# Altium project ALCT_MEZ_SPARTAN6.PrjPcb (part 5 of 5)

## Sheet ADC.SchDoc: ADC
size A; Organization: UCLA High Energy Physics; DocumentNumber: 8; Revision: 2.0; SheetNumber: 8; SheetTotal: 12; CurrentDate: 8/7/2018; ModifiedDate: 8/20/2018
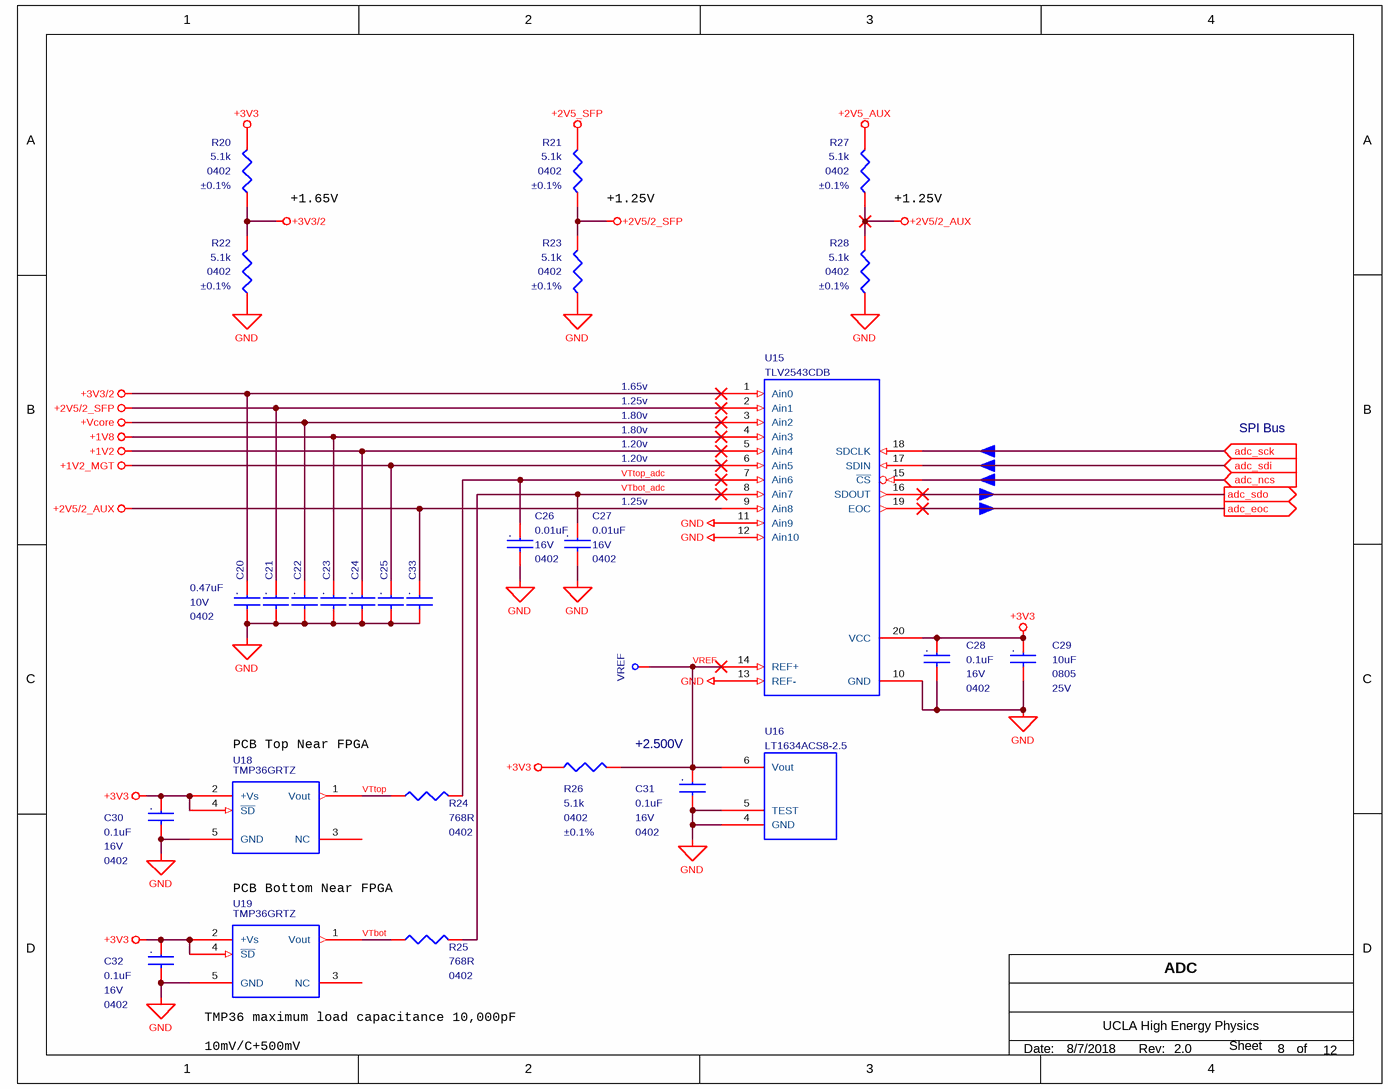
[diagram p15: ADC.SchDoc]

### Parts
C20  0.47uF  package: 0402  Voltage - Rated: 10V  [MC_S6/SM/C_0402_IPC]
C21  0.47uF  [MC_S6/SM/C_0402_IPC]  (value not drawn)
C22  0.47uF  [MC_S6/SM/C_0402_IPC]  (value not drawn)
C23  0.47uF  [MC_S6/SM/C_0402_IPC]  (value not drawn)
C24  0.47uF  [MC_S6/SM/C_0402_IPC]  (value not drawn)
C25  0.47uF  [MC_S6/SM/C_0402_IPC]  (value not drawn)
C26  0.01uF  Voltage - Rated: 16V  package: 0402  [MC_S6/SM/C_0402_IPC]
C27  0.01uF  Voltage - Rated: 16V  package: 0402  [MC_S6/SM/C_0402_IPC]
C28  0.1uF  package: 0402  Voltage - Rated: 16V  [MC_S6/SM/C_0402_IPC]
C29  10uF  Voltage - Rated: 25V  package: 0805  [MC_S6/SM/C_0805_IPC]
C30  0.1uF  package: 0402  Voltage - Rated: 16V  [MC_S6/SM/C_0402_IPC]
C31  0.1uF  package: 0402  Voltage - Rated: 16V  [MC_S6/SM/C_0402_IPC]
C32  0.1uF  package: 0402  Voltage - Rated: 16V  [MC_S6/SM/C_0402_IPC]
C33  0.47uF  [MC_S6/SM/C_0402_IPC]  (value not drawn)
R20  5.1k  Tolerance: ±0.1%  Supplier Device Package: 0402  [MC_S6/SM/R_0402_IPC]
R21  5.1k  Tolerance: ±0.1%  Supplier Device Package: 0402  [MC_S6/SM/R_0402_IPC]
R22  5.1k  Tolerance: ±0.1%  Supplier Device Package: 0402  [MC_S6/SM/R_0402_IPC]
R23  5.1k  Tolerance: ±0.1%  Supplier Device Package: 0402  [MC_S6/SM/R_0402_IPC]
R24  768R  Supplier Device Package: 0402  [MC_S6/SM/R_0402_IPC]
R25  768R  Supplier Device Package: 0402  [MC_S6/SM/R_0402_IPC]
R26  5.1k  Tolerance: ±0.1%  Supplier Device Package: 0402  [MC_S6/SM/R_0402_IPC]
R27  5.1k  Tolerance: ±0.1%  Supplier Device Package: 0402  [MC_S6/SM/R_0402_IPC]
R28  5.1k  Tolerance: ±0.1%  Supplier Device Package: 0402  [MC_S6/SM/R_0402_IPC]
U15  TLV2543CDB  [MC_S6/SM/ADC_DB20]
U16  LT1634ACS8-2.5  [MC_S6/SM/LT1634_SOIC8]
U18  TMP36GRTZ  [MC_S6/SM/SOT23_RJ5]
U19  TMP36GRTZ  [MC_S6/SM/SOT23_RJ5]
VREF  Test Point Via  [MC_S6/TH/TPVIA]  (value not drawn)  (no BOM)

### Ports
adc_eoc (out), adc_ncs (in), adc_sck (in), adc_sdi (in), adc_sdo (out)

### Nets
+1V2: C24.1 U15.5(Ain4)
+1V2_MGT: C25.1 U15.6(Ain5)
+1V8: C23.1 U15.4(Ain3)
+2V5/2_AUX: C33.1 R27.2 R28.1 U15.9(Ain8)
+2V5/2_SFP: C21.1 R21.2 R23.1 U15.2(Ain1)
+2V5_AUX: R27.1
+2V5_SFP: R21.1
+3V3: C28.1 C29.1 C30.1 C32.1 R20.1 R26.1 U15.20(VCC) U18.2(+Vs) U18.4(~{SD}) U19.2(+Vs) U19.4(~{SD})
+3V3/2: C20.1 R20.2 R22.1 U15.1(Ain0)
+Vcore: C22.1 U15.3(Ain2)
GND: C20.2 C21.2 C22.2 C23.2 C24.2 C25.2 C26.2 C27.2 C28.2 C29.2 C30.2 C31.2 C32.2 C33.2 R22.2 R23.2 R28.2 U15.10(GND) U15.11(Ain9) U15.12(Ain10) U15.13(REF-) U16.4(GND) U16.5(TEST) U18.5(GND) U19.5(GND)
adc_eoc: U15.19(EOC) ; port adc_eoc
adc_ncs: U15.15(~{CS}) ; port adc_ncs
adc_sck: U15.18(SDCLK) ; port adc_sck
adc_sdi: U15.17(SDIN) ; port adc_sdi
adc_sdo: U15.16(SDOUT) ; port adc_sdo
VREF: C31.1 R26.2 U15.14(REF+) U16.6(Vout) VREF.1(In)
VTbot: R25.1 U19.1(Vout)
VTbot_adc: C27.1 R25.2 U15.8(Ain7)
VTtop: R24.1 U18.1(Vout)
VTtop_adc: C26.1 R24.2 U15.7(Ain6)

Not connected (* = marked no-connect by the designer): U18 3(NC); U19 3(NC)

### Notes on the sheet
- +1.65V
- (near R21) +1.25V
- (near R27) +1.25V
- 1.65v
- 1.25v
- 1.80v
- 1.20v
- SPI Bus
- (near C27) 1.25v
- (near U18) PCB Top Near FPGA
- +2.500V
- PCB Bottom Near FPGA
- (near U19) TMP36 maximum load capacitance 10,000pF
- 10mV/C+500mV
- Date:
- Rev:
- of
- Sheet
- (in symbol C0402C103K4RACTU) .
- (in symbol C0402C104K4RACTU) .
- (in symbol GRM21BR61E106KA73L) .
- (in symbol GRM155R61A474KE15J) .

### Library data of the parts
C20-C25 C33 = GRM155R61A474KE15J: CAP CER 0.47UF 10V X5R 0402; Manufacturer: Murata Electronics North America; Capacitance: 0.47µF; Tolerance: ±10%; Supplier 1: Digi-Key; Manufacturer Part Number: GRM155R61A474KE15J; RoHS: RoHS Compliant; Category: Capacitors; Stock 1: 35266; Pricing 1: 1=0.1, 10=0.074, 100=0.0329, 500=0.02348, 1000=0.01845, 2500=0.01678, 5000=0.01543 (USD); Packaging: Cut Tape (CT); Part Status: Active; Operating Temperature: -55°C ~ 85°C; Features: -; Ratings: -; Applications: General Purpose; Mounting Type: Surface Mount, MLCC; Package / Case: 0402 (1005 Metric); Size / Dimension: 0.039" L x 0.020" W (1.00mm x 0.50mm); Height - Seated (Max): -; Thickness (Max): 0.022" (0.55mm); Lead Spacing: -; ComponentLink1URL: http://www.murata.com/~/media/webrenewal/support/library/catalog/products/capacitor/mlcc/c02e.ashx; ComponentLink1Description: http://www.murata.com/~/media/webrenewal/support/library/catalog/products/capacitor/mlcc/c02e.ashx; Supplier 2: Digi-Key; Stock 2: 35286; Pricing 2: 1=0.1, 10=0.074, 100=0.0329, 500=0.02348, 1000=0.01845, 2500=0.01678, 5000=0.01543 (USD); Supplier Part Number 1: 490-6305-1-ND; Supplier Part Number 2: 490-6305-6-ND; Temperature Coefficient: X5R
  C21-C25 C33: package: 0402; Voltage - Rated: 10V
C26 C27 = C0402C103K4RACTU: CAP CER 10nF 16V X7R 0402; Manufacturer: KEMET; Capacitance: 10000pF; Tolerance: ±10%; Supplier 1: Digi-Key; Manufacturer Part Number: C0402C103K4RACTU; RoHS: RoHS Compliant; Category: Capacitors; Stock 1: 605739; Pricing 1: 1=0.1, 10=0.02, 25=0.0144, 50=0.0108, 100=0.0088, 250=0.00732, 500=0.00626, 1000=0.00492, 5000=0.00412 (USD); Packaging: Cut Tape (CT); Part Status: Active; Temperature Coefficient: X7R; Operating Temperature: -55°C ~ 125°C; Features: -; Ratings: -; Applications: General Purpose; Mounting Type: Surface Mount, MLCC; Package / Case: 0402 (1005 Metric); Size / Dimension: 0.039" L x 0.020" W (1.00mm x 0.50mm); Height - Seated (Max): -; Thickness (Max): 0.022" (0.55mm); Lead Spacing: -; Lead Style: -; ComponentLink1URL: http://www.kemet.com/docfinder?Partnumber=C0402C103K4RACTU; ComponentLink1Description: http://www.kemet.com/docfinder?Partnumber=C0402C103K4RACTU; Supplier 2: Digi-Key; Stock 2: 605739; Pricing 2: 1=0.1, 10=0.02, 25=0.0144, 50=0.0108, 100=0.0088, 250=0.00732, 500=0.00626, 1000=0.00492, 5000=0.00412 (USD); Supplier Part Number 1: 399-1038-1-ND; Supplier Part Number 2: 399-1038-6-ND; Failure Rate: -
C28 C30-C32 = C0402C104K4RACTU: CAP CER 0.1UF 16V X7R 0402; Manufacturer: KEMET; Capacitance: 0.10µF; Tolerance: ±10%; Supplier 1: Digi-Key; Manufacturer Part Number: C0402C104K4RACTU; RoHS: RoHS Compliant; Category: Capacitors; Stock 1: 3565698; Pricing 1: 1=0.11, 10=0.078, 25=0.0568, 50=0.0442, 100=0.0365, 250=0.03024, 500=0.02562, 1000=0.02121, 5000=0.01806 (USD); Packaging: Cut Tape (CT); Part Status: Active; Operating Temperature: -55°C ~ 125°C; Features: -; Ratings: -; Applications: General Purpose; Failure Rate: -; Mounting Type: Surface Mount, MLCC; Package / Case: 0402 (1005 Metric); Size / Dimension: 0.039" L x 0.020" W (1.00mm x 0.50mm); Height - Seated (Max): -; Thickness (Max): 0.022" (0.55mm); Lead Spacing: -; Lead Style: -; ComponentLink1URL: http://www.kemet.com/docfinder?Partnumber=C0402C104K4RACTU; ComponentLink1Description: http://www.kemet.com/docfinder?Partnumber=C0402C104K4RACTU; Supplier 2: Digi-Key; Stock 2: 3565998; Pricing 2: 1=0.11, 10=0.078, 25=0.0568, 50=0.0442, 100=0.0365, 250=0.03024, 500=0.02562, 1000=0.02121, 5000=0.01806 (USD); Supplier Part Number 1: 399-3521-1-ND; Supplier Part Number 2: 399-3521-6-ND; Temperature Coefficient: X7R
C29 = GRM21BR61E106KA73L: CAP CER 10UF 25V X5R 0805; Manufacturer: Murata Electronics North America; Capacitance: 10µF; Tolerance: ±10%; Supplier 1: Digi-Key; Manufacturer Part Number: GRM21BR61E106KA73L; RoHS: RoHS Compliant; Category: Capacitors; Stock 1: 607428; Pricing 1: 1=0.19, 10=0.13, 50=0.0748, 100=0.0618, 250=0.052, 500=0.04356, 1000=0.03575 (USD); Packaging: Cut Tape (CT); Part Status: Active; Temperature Coefficient: X5R; Operating Temperature: -55°C ~ 85°C; Features: -; Ratings: -; Applications: General Purpose; Mounting Type: Surface Mount, MLCC; Package / Case: 0805 (2012 Metric); Size / Dimension: 0.079" L x 0.049" W (2.00mm x 1.25mm); Height - Seated (Max): -; Thickness (Max): 0.053" (1.35mm); Lead Spacing: -; Lead Style: -; ComponentLink1URL: http://www.murata.com/~/media/webrenewal/support/library/catalog/products/capacitor/mlcc/c02e.pdf; ComponentLink1Description: http://www.murata.com/~/media/webrenewal/support/library/catalog/products/capacitor/mlcc/c02e.pdf; Supplier 2: Digi-Key; Supplier Part Number 1: 490-5523-1-ND; Supplier Part Number 2: 490-5523-6-ND
R20-R23 R26-R28 = ERA-2AEB512X: RES SMD 5.1K OHM 0.1% 1/16W 0402; Manufacturer: Panasonic Electronic Components; Power (Watts): 0.063W, 1/16W; Temperature Coefficient: ±25ppm/°C; Supplier 1: Digi-Key; Manufacturer Part Number: ERA-2AEB512X; RoHS: RoHS Compliant; Category: Resistors; Stock 1: 26098; Pricing 1: 1=0.61, 50=0.238, 100=0.1913, 250=0.14876, 500=0.1122, 1000=0.0867, 5000=0.0646 (USD); Packaging: Cut Tape (CT); Part Status: Active; Resistance (Ohms): 5.1k; Composition: Thin Film; Features: Automotive AEC-Q200; Operating Temperature: -55°C ~ 155°C; Package / Case: 0402 (1005 Metric); Size / Dimension: 0.039" L x 0.020" W (1.00mm x 0.50mm); Height - Seated (Max): 0.016" (0.40mm); Number of Terminations: 2; Failure Rate: -; ComponentLink1URL: https://industrial.panasonic.com/cdbs/www-data/pdf/RDA0000/AOA0000C237.pdf; ComponentLink1Description: https://industrial.panasonic.com/cdbs/www-data/pdf/RDA0000/AOA0000C237.pdf; Supplier 2: Digi-Key; Stock 2: 26098; Pricing 2: 1=0.61, 50=0.238, 100=0.1913, 250=0.14876, 500=0.1122, 1000=0.0867, 5000=0.0646 (USD); Supplier Part Number 1: P5.1KDCCT-ND; Supplier Part Number 2: P5.1KDCDKR-ND
R24 R25 = ERJ-2RKF7680X: RES SMD 768 OHM 5.0% 1/10W 0402; Manufacturer: Panasonic Electronic Components; Tolerance: ±1%; Power (Watts): 0.1W, 1/10W; Temperature Coefficient: ±100ppm/°C; Supplier 1: Digi-Key; Manufacturer Part Number: ERJ-2RKF7680X; RoHS: RoHS Compliant; Category: Resistors; Stock 1: 54378; Pricing 1: 1=0.1, 10=0.039, 100=0.016, 1000=0.00719, 2500=0.00624, 5000=0.00515 (USD); Packaging: Cut Tape (CT); Part Status: Active; Composition: Thick Film; Features: Automotive AEC-Q200; Operating Temperature: -55°C ~ 155°C; Package / Case: 0402 (1005 Metric); Size / Dimension: 0.039" L x 0.020" W (1.00mm x 0.50mm); Height - Seated (Max): 0.016" (0.40mm); Failure Rate: -; ComponentLink1URL: https://industrial.panasonic.com/cdbs/www-data/pdf/RDA0000/AOA0000C304.pdf; ComponentLink1Description: https://industrial.panasonic.com/cdbs/www-data/pdf/RDA0000/AOA0000C304.pdf; Supplier 2: Digi-Key; Stock 2: 54378; Pricing 2: 1=0.1, 10=0.039, 100=0.016, 1000=0.00719, 2500=0.00624, 5000=0.00515 (USD); Supplier Part Number 1: P768LCT-ND; Supplier Part Number 2: P768LDKR-ND
U15 = TLV2543CDB: IC SERIAL OUT A/D 11-CH 20-SSOP; Manufacturer: Texas Instruments; Manufacturer Part Number: TLV2543CDBR; COMPSIDE: TOP; COMPGROUP: 0; COMPROT: 270; mfgr: Texas Inst; mfgr_foot: DB20; Number of Bits: 12; Sampling Rate (Per Second): 66k; Number of Inputs: 11; Input Type: Single Ended; Data Interface: SPI; Configuration: MUX-S/H-ADC; Ratio - S/H:ADC: 1:1; Number of A/D Converters: 1; Architecture: SAR; Reference Type: External; Voltage - Supply, Analog: 3 V ~ 3.6 V; mfgr_id: TLV2543CDB; Supplier 1: Digi-Key; RoHS: RoHS Compliant; Category: Integrated Circuits (ICs); Stock 1: 505; Pricing 1: 1=12.64, 10=11.596, 100=9.7894, 500=8.68224, 1000=7.98299 (USD); Packaging: Cut Tape (CT); Part Status: Active; Voltage - Supply, Digital: 3 V ~ 3.6 V; Features: -; Operating Temperature: 0°C ~ 70°C; Package / Case: 20-SSOP (0.209", 5.30mm Width); Supplier Device Package: 20-SSOP; ComponentLink1URL: http://www.ti.com/lit/ds/symlink/tlv2543.pdf; ComponentLink1Description: http://www.ti.com/lit/ds/symlink/tlv2543.pdf; Supplier 2: Digi-Key; Stock 2: 505; Pricing 2: 1=12.64, 10=11.596, 100=9.7894, 500=8.68224, 1000=7.98299 (USD); Supplier Part Number 1: 296-10643-1-ND; Supplier Part Number 2: 296-10643-6-ND
U16 = LT1634_2.5V: IC VREF SHUNT 2.5V 8SOIC; Manufacturer: Linear Technology; Manufacturer Part Number: LT1634ACS8-2.5#PBF; COMPSIDE: TOP; COMPGROUP: 0; COMPROT: 270; mfgr: Linear Tech; mfgr_foot: SOIC8; Output Type: Fixed; Current - Output: 50mA; Tolerance: ±0.05%; Temperature Coefficient: 10ppm/°C; Noise - 0.1Hz to 10Hz: 15µVp-p; Current - Cathode: 8µA; mfgr_id: LT1634ACS8-2.5; Supplier 1: Digi-Key; RoHS: RoHS Compliant; Category: Integrated Circuits (ICs); Stock 1: 1010; Pricing 1: 1=9.42, 25=6.256, 100=4.7109 (USD); Packaging: Tube; Part Status: Active; Reference Type: Shunt; Voltage - Output (Min/Fixed): 2.5V; Voltage - Output (Max): -; Noise - 10Hz to 10kHz: -; Voltage - Input: -; Current - Supply: -; Operating Temperature: 0°C ~ 70°C (TA); Mounting Type: Surface Mount; Package / Case: 8-SOIC (0.154", 3.90mm Width); Supplier Device Package: 8-SOIC; ComponentLink1URL: http://www.linear.com/docs/3209; ComponentLink1Description: http://www.linear.com/docs/3209; Supplier Part Number 1: LT1634ACS8-2.5#PBF-ND
U18 U19 = TMP36GRTZ: SENSOR TEMP ANLG VOLT SOT-23-5; Manufacturer: Analog Devices Inc.; Manufacturer Part Number: TMP36FSZ-REEL; mfgr: Analog Devices; mfgr_foot: SOT23_RJ5; Sensor Type: Analog, Local; Sensing Temperature - Local: -40°C ~ 125°C; Output Type: Analog Voltage; Voltage - Supply: 2.7 V ~ 5.5 V; Resolution: 10mV/°C; Accuracy - Highest (Lowest): ±2°C (±3°C); Test Condition: 25°C (-40°C ~ 125°C); mfgr_id: TMP36GRTZ; Supplier 1: Digi-Key; RoHS: RoHS Compliant; Category: Sensors, Transducers; Stock 1: 63; Pricing 1: 1=2.09, 10=1.876, 100=1.5077, 500=1.23874, 1000=1.02638 (USD); Packaging: Cut Tape (CT); Part Status: Active; Sensing Temperature - Remote: -; Features: Shutdown Mode; Operating Temperature: -40°C ~ 150°C; Mounting Type: Surface Mount; Package / Case: 8-SOIC (0.154", 3.90mm Width); Supplier Device Package: 8-SOIC; ComponentLink1URL: http://www.analog.com/media/en/technical-documentation/data-sheets/TMP35_36_37.pdf; ComponentLink1Description: http://www.analog.com/media/en/technical-documentation/data-sheets/TMP35_36_37.pdf; Supplier 2: Digi-Key; Stock 2: 63; Pricing 2: 1=2.09, 10=1.876, 100=1.5077, 500=1.23874, 1000=1.02638 (USD); Supplier Part Number 1: TMP36FSZ-REELCT-ND; Supplier Part Number 2: TMP36FSZ-REELDKR-ND
VREF = TPVIA: COMPSIDE: TOP; COMPGROUP: 0; mfgr: Layout; COMPROT: 0; Package: 90; mfgr_id: TPVIA; mfgr_foot: TPVIA

## Sheet Mechanical.SchDoc: Mechanical
size A; Organization: UCLA High Energy Physics; DocumentNumber: 12; Revision: 1.0; SheetNumber: 12; SheetTotal: 12; CurrentDate: 8/7/2018; ModifiedDate: 2/7/2018; ProjectName: ALCT S-6 Optical Mezzanine
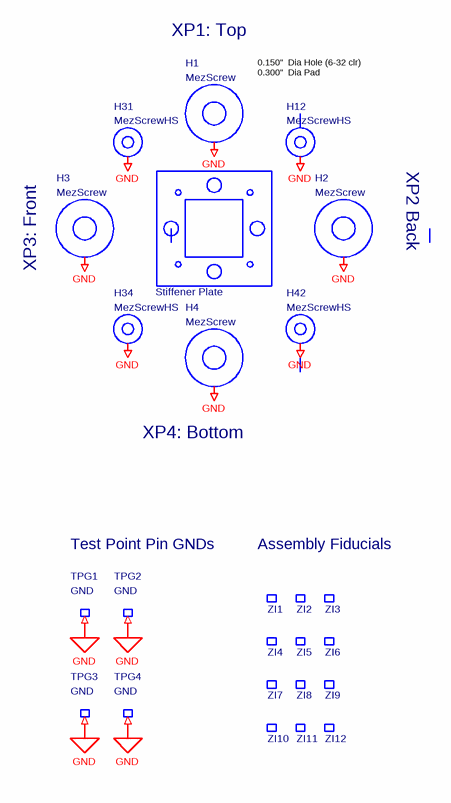
[diagram p16: Mechanical.SchDoc]

### Parts
H1  MezScrew  [MC_S6/TH/SCREW_BASE]  (no BOM)
H2  MezScrew  [MC_S6/TH/SCREW_BASE]  (no BOM)
H3  MezScrew  [MC_S6/TH/SCREW_BASE]  (no BOM)
H4  MezScrew  [MC_S6/TH/SCREW_BASE]  (no BOM)
H12  MezScrewHS  [MC_S6/TH/SCREW_PLATE]  (no BOM)
H31  MezScrewHS  [MC_S6/TH/SCREW_PLATE]  (no BOM)
H34  MezScrewHS  [MC_S6/TH/SCREW_PLATE]  (no BOM)
H42  MezScrewHS  [MC_S6/TH/SCREW_PLATE]  (no BOM)
SP1  Stiffener Plate  [MC_S6/SPLATE]  (no BOM)
TPG1  GND  [MC_S6/TH/TPGND]  (no BOM)
TPG2  GND  [MC_S6/TH/TPGND]  (no BOM)
TPG3  GND  [MC_S6/TH/TPGND]  (no BOM)
TPG4  GND  [MC_S6/TH/TPGND]  (no BOM)
ZI1  Fiducial Dot  [MC_S6/SM/FIDUCIAL_DOT]  (value not drawn)  (no BOM)
ZI2  Fiducial Dot  [MC_S6/SM/FIDUCIAL_DOT]  (value not drawn)  (no BOM)
ZI3  Fiducial Dot  [MC_S6/SM/FIDUCIAL_DOT]  (value not drawn)  (no BOM)
ZI4  Fiducial Dot  [MC_S6/SM/FIDUCIAL_DOT]  (value not drawn)  (no BOM)
ZI5  Fiducial Dot  [MC_S6/SM/FIDUCIAL_DOT]  (value not drawn)  (no BOM)
ZI6  Fiducial Dot  [MC_S6/SM/FIDUCIAL_DOT]  (value not drawn)  (no BOM)
ZI7  Fiducial Dot  [MC_S6/SM/FIDUCIAL_DOT]  (value not drawn)  (no BOM)
ZI8  Fiducial Dot  [MC_S6/SM/FIDUCIAL_DOT]  (value not drawn)  (no BOM)
ZI9  Fiducial Dot  [MC_S6/SM/FIDUCIAL_DOT]  (value not drawn)  (no BOM)
ZI10  Fiducial Dot  [MC_S6/SM/FIDUCIAL_DOT]  (value not drawn)  (no BOM)
ZI11  Fiducial Dot  [MC_S6/SM/FIDUCIAL_DOT]  (value not drawn)  (no BOM)
ZI12  Fiducial Dot  [MC_S6/SM/FIDUCIAL_DOT]  (value not drawn)  (no BOM)

### Nets
GND: H1.1(GND) H2.1(GND) H3.1(GND) H4.1(GND) H12.1(GND) H31.1(GND) H34.1(GND) H42.1(GND) TPG1.1(In) TPG2.1(In) TPG3.1(In) TPG4.1(In)

Not connected (* = marked no-connect by the designer): ZI1 1(NC); ZI2 1(NC); ZI3 1(NC); ZI4 1(NC); ZI5 1(NC); ZI6 1(NC); ZI7 1(NC); ZI8 1(NC); ZI9 1(NC); ZI10 1(NC); ZI11 1(NC); ZI12 1(NC)

### Notes on the sheet
- XP1: Top
- 0.150"  Dia Hole (6-32 clr)
  0.300"  Dia Pad
- XP2 Back
- (near H3) XP3: Front
- (near H4) XP4: Bottom
- Test Point Pin GNDs
- Assembly Fiducials
- Date:
- Rev:
- of
- Sheet

### Library data of the parts
H1-H4 = MezScrew: COMPSIDE: TOP; COMPGROUP: 0; mfgr_id: 92949A146; mfgr: McMaster; mfgr_foot: 6-32 ButtonSkt; COMPROT: 0
H12 H31 H34 H42 = MezScrewHS: mfgr_foot: 6-32 ButtonSkt; mfgr: McMaster; mfgr_id: 92949A146; COMPROT: 0; COMPSIDE: TOP; COMPGROUP: 0
SP1 = SPlate_MC_S6
TPG1-TPG4 = TPGND: mfgr_id: 2341; mfgr: Mill-Max; mfgr_foot: Turret; silk: What; COMPROT: 0; COMPSIDE: TOP; Package: 90; COMPGROUP: 0
ZI1-ZI12 = Fiducial_dot: mfgr_foot: FID; mfgr: Layout; COMPROT: 0; COMPSIDE: TOP; mfgr_id: FID; Package: 90; COMPGROUP: 0

## Nets that join several sheets
+1V2: VTTX (R102.2), FPGA_Power (43 pins), Power (5 pins), ADC (C24.1 U15.5)
+1V2_MGT: MGT (17 pins), Power (5 pins), ADC (C25.1 U15.6)
+1V8: Configuration_Logic (6 pins), Configuration_Power (8 pins), VTTX (C117.1 U101.1 U101.5), Power (5 pins), ADC (C23.1 U15.4)
+2V5_AUX: Configuration_Logic (10 pins), Configuration_Power (C59.1 C60.1 C70.1 C71.1), FPGA_Power (42 pins), Power (5 pins), ADC (R27.1)
+2V5_SFP: VTTX (6 pins), Power (6 pins), ADC (R21.1)
+3V3: Connectors (32 pins), Configuration_Logic (35 pins), Configuration_Power (20 pins), MGT (17 pins), VTTX (5 pins), FPGA_Power (116 pins), Power (21 pins), ADC (11 pins)
+Vcore: Connectors (32 pins), VTTX (R100.1), Power (17 pins), ADC (C22.1 U15.3)
GND: Connectors (101 pins), Configuration_Logic (56 pins), Configuration_Power (32 pins), MGT (60 pins), VTTX (28 pins), FPGA_Power (73 pins), FPGA_Ground (148 pins), Power (47 pins), ADC (25 pins), Mechanical (12 pins)
/PROGR: Connectors (XP2.D34), Configuration_Logic (6 pins)
led1: Connectors (XP2.A25), Configuration_Logic (U1.AA29)
led2: Connectors (XP2.A26), Configuration_Logic (U1.U28)
led3: Connectors (XP2.A27), Configuration_Logic (U1.U29)
led4: Connectors (XP2.A28), Configuration_Logic (U1.R29)
led5: Connectors (XP2.B25), Configuration_Logic (U1.AA30)
led6: Connectors (XP2.B26), Configuration_Logic (U1.U30)
led7: Connectors (XP2.B27), Configuration_Logic (U1.N27)
led8: Connectors (XP2.B28), Configuration_Logic (U1.T27)
led9: Connectors (XP2.B29), Configuration_Logic (U1.R28)
led10: Connectors (XP2.B30), Configuration_Logic (U1.G25)
led11: Connectors (XP2.C25), Configuration_Logic (U1.Y30)
led12: Connectors (XP2.C26), Configuration_Logic (U1.U27)
led13: Connectors (XP2.C27), Configuration_Logic (U1.T28)
led14: Connectors (XP2.C28), Configuration_Logic (U1.P30)
led15: Connectors (XP2.C29), Configuration_Logic (U1.P28)
led16: Connectors (XP2.D25), Configuration_Logic (U1.P27)
led17: Connectors (XP2.D26), Configuration_Logic (U1.N28)
led18: Connectors (XP2.D27), Configuration_Logic (U1.T30)
led19: Connectors (XP2.D28), Configuration_Logic (U1.R30)
led20: Connectors (XP2.D29), Configuration_Logic (U1.N30)
mez_clock: Connectors (XP2.D21), Configuration_Logic (TTCCLK.1 U4.2)
sfp_tx2_n: MGT (U1.A11), VTTX (J1.13)
sfp_tx2_p: MGT (U1.B11), VTTX (J1.12)
sfp_tx_n: MGT (U1.A9), VTTX (J1.19)
sfp_tx_p: MGT (U1.B9), VTTX (J1.18)
TCK_Pr: Connectors (XP2.D7), Configuration_Logic (TCK.1 U8.3)
TDI_Pr: Connectors (XP2.C8), Configuration_Logic (TDI.1 U7.3)
TDO_Pr: Connectors (XP2.D8), Configuration_Logic (TDO.1 U10.3)
TMS_Pr: Connectors (XP2.C7), Configuration_Logic (TMS.1 U9.3)